# EAGLE design MCP73871 (EAGLE 8.2.2)
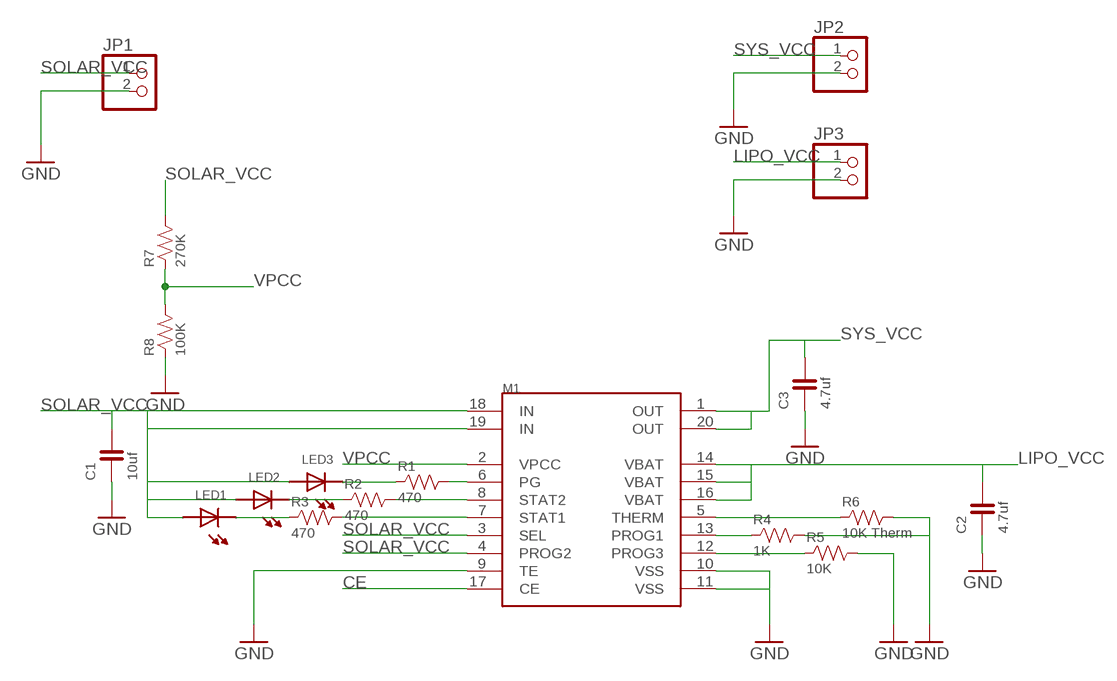
[diagram p0: schematic, sheet 1]

## Parts
C1  10uf  CAPACITOR-0603  [0603]
C2  4.7uf  CAPACITOR-0603  [0603]
C3  4.7uf  CAPACITOR-0603  [0603]
JP1  PINHD-1X2  [1X02]
JP2  PINHD-1X2  [1X02]
JP3  PINHD-1X2  [1X02]
LED1  LED-0603  [0603]
LED2  LED-0603  [0603]
LED3  LED-0603  [0603]
M1  MCP73871  [QFN]
R1  470  RESISTOR-0603  [0603]
R2  470  RESISTOR-0603  [0603]
R3  470  RESISTOR-0603  [0603]
R4  1K  RESISTOR-0603  [0603]
R5  10K  RESISTOR-0603  [0603]
R6  10K Therm  RESISTOR-0603  [0603]
R7  270K  RESISTOR-0603  [0603]
R8  100K  RESISTOR-0603  [0603]

## Nets
CE: M1.17(CE)
GND: C1.1 C2.1 C3.1 JP1.2 JP2.2 JP3.2 M1.9(TE) M1.10(VSS) M1.11(VSS) R4.2 R5.2 R6.2 R8.1
LIPO_VCC: C2.2 JP3.1 M1.14(VBAT) M1.15(VBAT) M1.16(VBAT)
N$1: LED3.CATHODE R1.1
N$2: LED2.CATHODE R2.1
N$3: M1.5(THERM) R6.1
N$7: M1.13(PROG1) R4.1
N$8: LED1.CATHODE R3.1
N$9: M1.12(PROG3) R5.1
N$11: M1.6(PG) R1.2
N$12: M1.8(STAT2) R2.2
N$13: M1.7(STAT1) R3.2
SOLAR_VCC: C1.2 JP1.1 LED1.ANODE LED2.ANODE LED3.ANODE M1.3(SEL) M1.4(PROG2) M1.18(IN) M1.19(IN) R7.2
SYS_VCC: C3.2 JP2.1 M1.1(OUT) M1.20(OUT)
VPCC: M1.2(VPCC) R7.1 R8.2

## Library data of the parts
C1-C3 = FaBo-Capacitor:CAPACITOR: CAPACITOR
JP1-JP3 = pinhead:PINHD-1X2: PIN HEADER
LED1-LED3 = FaBo-LED:LED
M1 = FaBo-Solar:MCP73871
R1-R8 = FaBo-Resistors:RESISTOR: RESISTOR

## Board
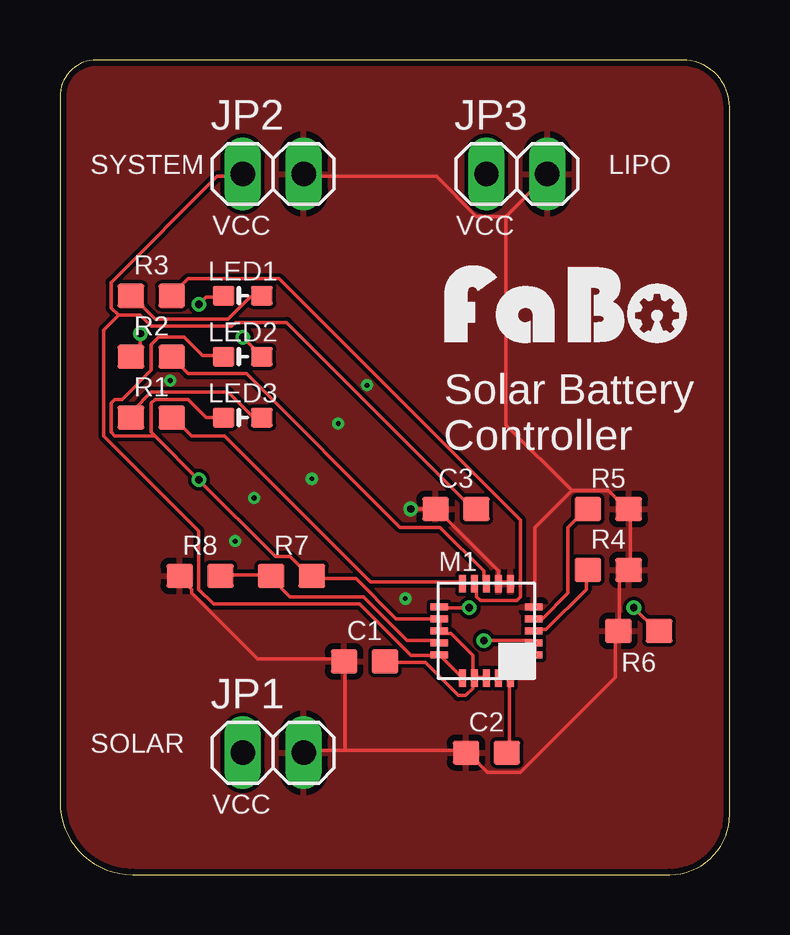
[diagram p1: board, top side]
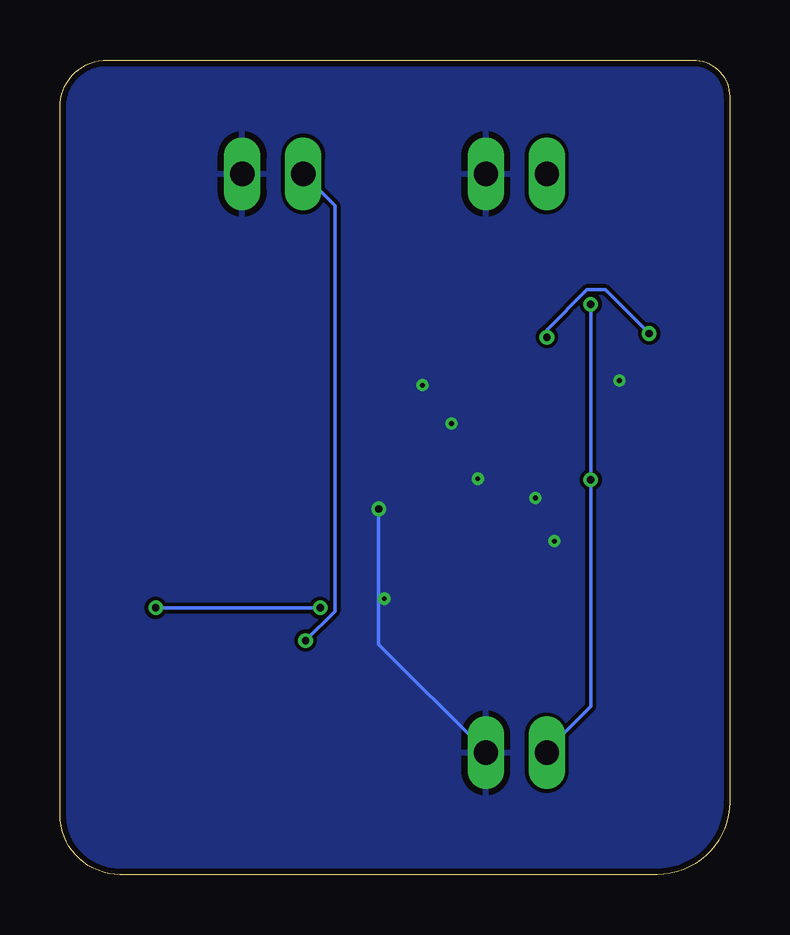
[diagram p2: board, bottom side, seen from below]

Size 27.92 x 33.96 mm. Coordinates in mm from the lower left corner, seen from the top.
Outline: 0,32.43 0,3.02 arc90 3.02,0 25.42,0 arc90 27.92,2.5 27.92,31.98 arc90 25.95,33.96 1.53,33.96 arc90 0,32.43
Copper layers (1*16): Top 0.035mm / dielectric 1.5mm / Bottom 0.035mm
Design rules "SeeedStudio_2layer_DRU_no_angle_20140221": minimum track width 6mil, minimum drill 12mil, track to track 6mil, track to pad 6mil, pad to pad 6mil, via to via 6mil, smd to smd 0mil, copper to edge 10mil, drill to drill 10mil, minimum pad ring 10mil, minimum via ring 6mil, stop-mask expansion 2mil, vias tented up to drill 100mil, thermal gap 10mil

### Footprints (pad centres in the part's own frame; a part is rotated, then mirrored left to right if it is on the bottom)
0603 = smd 1.1 x 1: 1 -0.85,0; 2 0.85,0
1X02 = drill 1.016 long: 1 -1.27,0; 2 1.27,0
0603' = smd 0.9 x 0.8: ANODE -0.8,0; CATHODE 0.8,0
QFN = smd 0.73 x 0.3: 1 -1.965,-1; 2 -1.965,-0.5; 3 -1.965,0; 4 -1.965,0.5; 5 -1.965,1; 11 1.965,1; 12 1.965,0.5; 13 1.965,0; 14 1.965,-0.5; 15 1.965,-1 | smd 0.3 x 0.73: 6 -1,1.965; 7 -0.5,1.965; 8 0,1.965; 9 0.5,1.965; 10 1,1.965; 16 1,-1.965; 17 0.5,-1.965; 18 0,-1.965; 19 -0.5,-1.965; 20 -1,-1.965

### Placement (x,y rotation side)
C1  12.7,8.89 0 top
C2  17.78,5.08 0 top
C3  16.51,15.24 0 top
JP1  8.89,5.08 0 top
JP2  8.89,29.21 0 top
JP3  19.05,29.21 0 top
LED1  [0603']  7.62,24.13 0 top
LED2  [0603']  7.62,21.59 0 top
LED3  [0603']  7.62,19.05 0 top
M1  17.78,10.16 0 top
R1  3.81,19.05 0 top
R2  3.81,21.59 0 top
R3  3.81,24.13 0 top
R4  22.86,12.7 0 top
R5  22.86,15.24 0 top
R6  24.13,10.16 180 top
R7  9.65,12.45 0 top
R8  5.84,12.45 0 top
U$1  [LOGO_FABO_MS]  21.08,21.78 0 top

### Tracks (layer width: path | path; a pad name or v marks a point on that pad's centre or on a via)
GND  (via drill 0.2, 0.3)
  Top 0.152: 18.59,27.43 17.37,27.43 15.7,29.11 10.21,29.11 JP2.2 | 18.59,27.43 20.27,29.11 JP3.2 | 21.34,16 19.81,14.48 19.81,11.28 M1.11 | 21.34,16 22.86,16 23.62,15.24 R5.2 23.77,15.24 23.77,12.8 R4.2 23.62,12.65 23.32,12.34 23.32,10.21 R6.2 23.16,10.06 23.16,8.23 19.2,4.27 17.83,4.27 17.07,5.03 C2.1 16.92,5.18 11.89,5.18 | 18.29,12.19 18.75,12.19 M1.10 | 18.29,12.19 18.29,12.65 15.7,15.24 C3.1 v14.63,15.24 | 18.29,12.19 M1.9 | 11.89,5.18 10.21,5.18 JP1.2 | 11.89,5.18 11.89,8.84 C1.1 11.73,8.99 8.23,8.99 5.49,11.73 5.49,11.89 5.03,12.34 R8.1 | 18.59,27.43 18.59,18.75 21.34,16
  Bottom 0.152: v14.63,15.24 14.63,9.6 10.21,5.18 JP1.2
  other vias: 7.3,13.9 8.1,15.7 10.5,16.5 11.6,18.8 12.8,20.4 14.4,11.5 4.6,20.6
  pour Bottom: 0,0 27.94,0 27.94,34.04 0,34.04
  pour Top: 0,0 27.94,0 27.94,34.04 0,34.04
LIPO_VCC  (via drill 0.3)
  Top 0.152: C2.2 18.75,5.18 18.75,8.08 M1.16 18.9,8.23 19.81,9.14 M1.15 19.81,9.3 19.81,9.6 M1.14 19.66,9.75 v17.68,9.75
  Bottom 0.152: v17.68,9.75 16.46,10.97 16.46,27.89 JP3.1
N$1
  Top 0.152: LED3.CATHODE 8.08,19.05 7.01,20.12 3.81,20.12 3.05,19.36 3.05,19.05 R1.1
N$2  (via drill 0.3)
  Top 0.152: v7.62,22.4 8.38,21.64 LED2.CATHODE | v3.35,22.55 3.35,21.95 3.05,21.64 R2.1
  Bottom 0.152: v7.62,22.4 7.62,22.71 5.94,24.38 5.18,24.38 v3.35,22.55
N$3  (via drill 0.3)
  Top 0.152: v17.07,11.12 15.85,11.12 M1.5 | v23.93,11.12 24.84,10.21 R6.1
  Bottom 0.152: v23.93,11.12 v17.07,11.12
N$7
  Top 0.152: M1.13 19.81,10.21 20.27,10.21 21.95,11.89 21.95,12.65 R4.1
N$8
  Top 0.152: LED1.CATHODE 8.38,24.08 7.92,24.08 7.01,23.16 3.96,23.16 3.05,24.08 R3.1
N$9
  Top 0.152: M1.12 19.81,10.67 20.12,10.67 21.18,11.73 21.18,14.48 21.95,15.24 R5.1
N$11
  Top 0.152: M1.6 16.76,12.19 12.95,12.19 6.86,18.29 5.49,18.29 4.72,19.05 R1.2
N$12
  Top 0.152: M1.8 17.68,12.19 17.68,12.65 15.85,14.48 14.17,14.48 7.77,20.88 5.33,20.88 4.72,21.49 R2.2
N$13
  Top 0.152: M1.7 17.37,12.04 17.37,11.58 17.53,11.43 19.05,11.43 19.2,11.58 19.2,14.78 9.14,24.84 5.33,24.84 4.72,24.23 R3.2
SOLAR_VCC  (via drill 0.3)
  Top 0.152: v5.79,23.77 6.1,24.08 6.71,24.08 LED1.ANODE | M1.19 17.37,8.23 17.68,8.23 M1.18 | M1.19 17.22,8.23 17.22,9.14 16.31,10.06 15.85,10.06 M1.3 15.85,10.21 15.85,10.52 M1.4 15.7,10.67 14.02,10.67 12.34,12.34 10.52,12.34 R7.2 10.36,12.5 9.6,13.26 8.99,13.26 v5.79,16.46 3.96,18.29 | C1.2 13.56,8.84 15.24,8.84 16.61,7.47 16.92,7.47 17.22,7.77 17.22,8.08 M1.19 | LED3.ANODE 6.1,19.05 5.33,19.81 3.96,19.81 3.81,19.66 3.81,18.44 3.96,18.29 | 3.96,18.29 2.29,18.29 2.13,18.44 2.13,19.66 2.29,19.81 2.59,19.81 3.81,21.03 3.81,22.1 4.12,22.4 5.18,22.4 5.94,21.64 6.71,21.64 LED2.ANODE
  Bottom 0.152: v5.79,23.77 v5.79,16.46 5.79,7.01 7.62,5.18 JP1.1
SYS_VCC
  Top 0.152: M1.20 16.76,8.23 15.85,9.14 M1.1 15.7,9.14 14.63,9.14 12.5,11.28 6.4,11.28 5.79,11.89 5.79,14.33 1.83,18.29 1.83,22.71 2.44,23.32 | 2.44,23.32 3.35,23.32 3.81,22.86 7.16,22.86 7.32,23.01 9.45,23.01 17.22,15.24 C3.2 | 2.44,23.32 2.13,23.62 2.13,24.69 6.55,29.11 7.62,29.11 JP2.1
VPCC
  Top 0.152: M1.2 15.7,9.75 14.48,9.75 12.65,11.58 9.6,11.58 8.84,12.34 R7.1 8.69,12.5 6.71,12.5 R8.2

### Text on the board
tPlace: SYSTEM | LIPO | VCC | VCC | Solar Battery / Controller | SOLAR | VCC